# EAGLE design boardv02 (EAGLE 9.6.2)
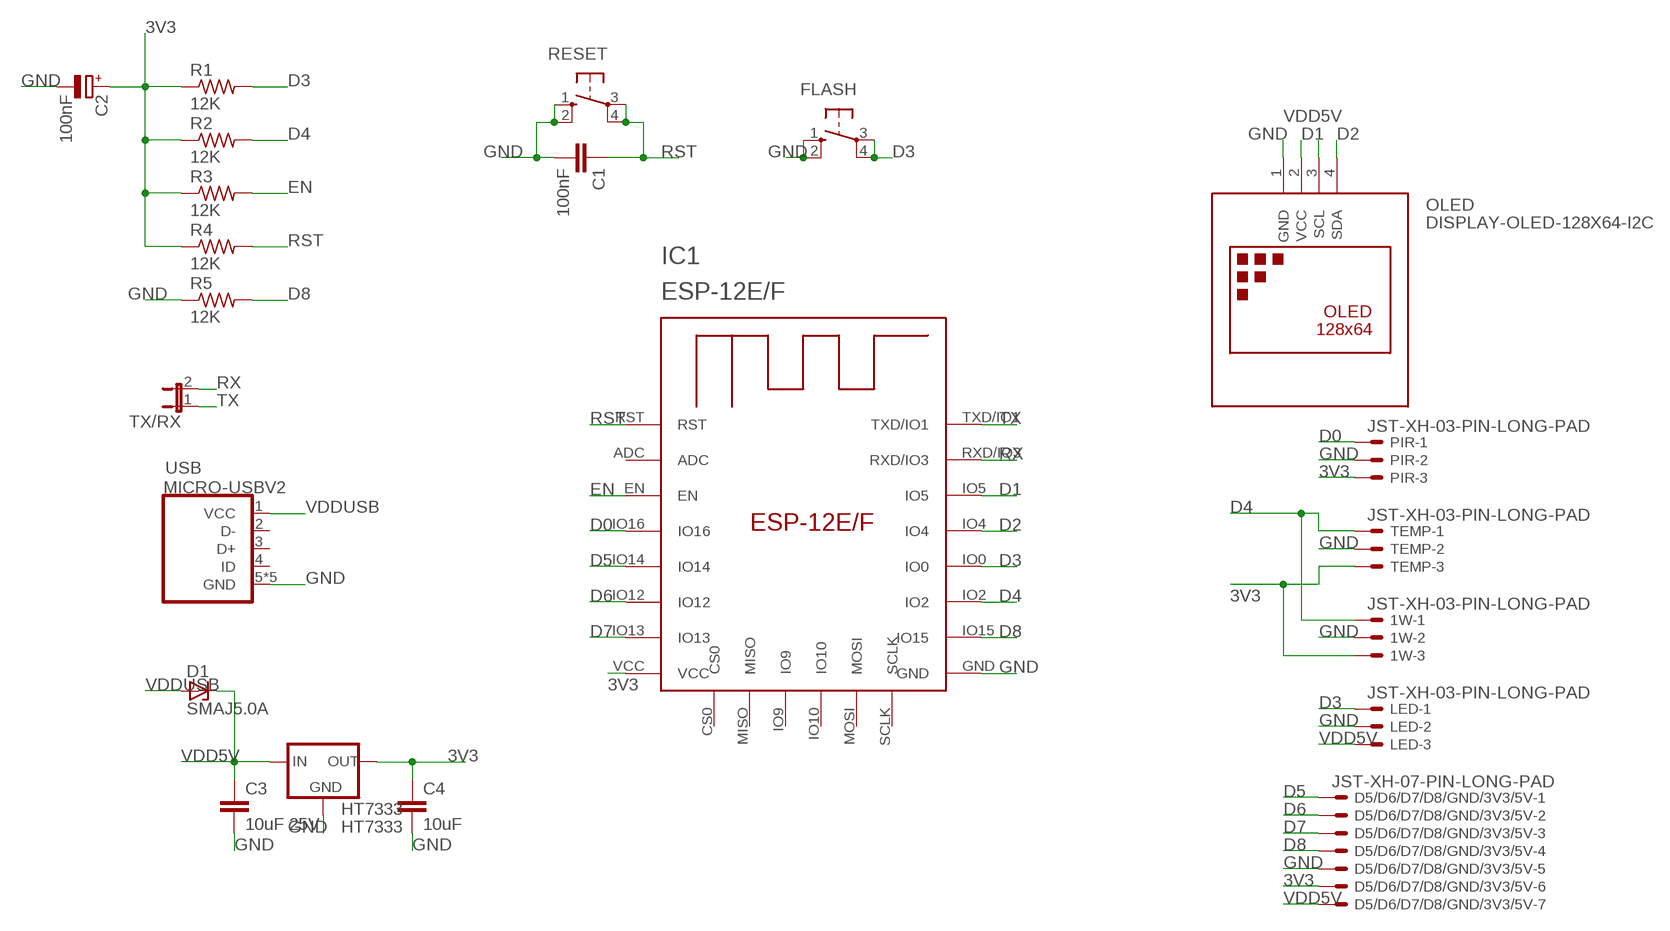
[diagram p0: schematic, sheet 1]

## Parts
1W  JST-XH-03-PIN-LONG-PAD  [JST-XH-03-PACKAGE-LONG-PAD]
C1  100nF  C-EUC0805  [C0805]
C2  100nF  CPOL-EUR/2012-12R  [R/2012-12R]
C3  10uF 25V  C-EUC0805  [C0805]
C4  10uF  C-EUC0805  [C0805]
D1  SMAJ5.0A  [DO214AC]
D5/D6/D7/D8/GND/3V3/5V  JST-XH-07-PIN-LONG-PAD  [JST-XH-07-PACKAGE-LONG-PAD]
FLASH  10-XX  [B3F-10XX]
HT7333  HT7333  [SOT-89]
IC1  ESP-12E/F  [ESP-12E]
LED  JST-XH-03-PIN-LONG-PAD  [JST-XH-03-PACKAGE-LONG-PAD]
OLED  DISPLAY-OLED-128X64-I2C  [DISPLAY-OLED-128X64-I2C]
PIR  JST-XH-03-PIN-LONG-PAD  [JST-XH-03-PACKAGE-LONG-PAD]
R1  12K  R-US_R1206  [R1206]
R2  12K  R-US_R1206  [R1206]
R3  12K  R-US_R1206  [R1206]
R4  12K  R-US_R1206  [R1206]
R5  12K  R-US_R1206  [R1206]
RESET  10-XX  [B3F-10XX]
TEMP  JST-XH-03-PIN-LONG-PAD  [JST-XH-03-PACKAGE-LONG-PAD]
TX/RX  JP1E  [JP1]
USB  MICRO-USBV2  [MICRO-USB-2]

## Nets
3V3: 1W.3 C2.+ C4.1 D5/D6/D7/D8/GND/3V3/5V.6 HT7333.1(OUT) IC1.VCC PIR.3 R1.1 R2.1 R3.1 R4.1 TEMP.3
D0: IC1.IO16 PIR.1
D1: IC1.IO5 OLED.3(SCL)
D2: IC1.IO4 OLED.4(SDA)
D3: FLASH.3(P) FLASH.4(P1) IC1.IO0 LED.1 R1.2
D4: 1W.1 IC1.IO2 R2.2 TEMP.1
D5: D5/D6/D7/D8/GND/3V3/5V.1 IC1.IO14
D6: D5/D6/D7/D8/GND/3V3/5V.2 IC1.IO12
D7: D5/D6/D7/D8/GND/3V3/5V.3 IC1.IO13
D8: D5/D6/D7/D8/GND/3V3/5V.4 IC1.IO15 R5.2
EN: IC1.EN R3.2
GND: 1W.2 C1.2 C2.- C3.2 C4.2 D5/D6/D7/D8/GND/3V3/5V.5 FLASH.1(S) FLASH.2(S1) HT7333.2(GND) IC1.GND LED.2 OLED.1(GND) PIR.2 R5.1 RESET.1(S) RESET.2(S1) TEMP.2 USB.5(GND) USB.P$1(GND) USB.P$2(GND) USB.P$3(GND) USB.P$4(GND)
RST: C1.1 IC1.RST R4.2 RESET.3(P) RESET.4(P1)
RX: IC1.RXD/IO3 TX/RX.2
TX: IC1.TXD/IO1 TX/RX.1
VDD5V: C3.1 D1.C D5/D6/D7/D8/GND/3V3/5V.7 HT7333.3(IN) HT7333.4(IN) LED.3 OLED.2(VCC)
VDDUSB: D1.A USB.1(VCC)
Unconnected: IC1.ADC IC1.CS0 IC1.IO9 IC1.IO10 IC1.MISO IC1.MOSI IC1.SCLK USB.2(D-) USB.3(D+) USB.4(ID)

## Library data of the parts
1W LED PIR TEMP = Rembrandt Electronics - JST XH Connectors v1-0:JST-XH-03-PIN: JST XH Connector 2 Pin Wire to board connector. Pitch: 2,54 mm, (0.100") Number of pins: 3 Created by Rembrandt Electronics www.rembrandtelectronics.com
C1 C3 C4 = resistor:C-EU: CAPACITOR, European symbol
C2 = resistor:CPOL-EU: POLARIZED CAPACITOR, European symbol
D1 = smaj_10:SMAJ*A: SMAJ Series TVS Diodes Source: http://www.littelfuse.com/~/media/electronics/datasheets/tvs_diodes/littelfuse_tvs_diode_smaj_datasheet.pdf.pdf; MF: Littelfuse; MPN: SMAJ5.0A; OC_FARNELL: 1827607; OC_NEWARK: 71J2029
D5/D6/D7/D8/GND/3V3/5V = Rembrandt Electronics - JST XH Connectors v1-0:JST-XH-07-PIN: JST XH Connector 2 Pin Wire to board connector. Pitch: 2,54 mm, (0.100") Number of pins: 7 Created by Rembrandt Electronics www.rembrandtelectronics.com
FLASH RESET = switch-omron:10-XX: OMRON SWITCH; MPN: B3F-1000; OC_FARNELL: 176432; OC_NEWARK: 36M3542
HT7333 = holtek2:HT73*
IC1 = esp-12e-f:ESP-12E/F
OLED = diy-modules:DISPLAY-OLED-128X64-I2C: 128x64 Dot Matrix OLED Module based on SSD1306 chip Variant with I2C interface More details available here: http://www.instructables.com/id/Monochrome-096-i2c-OLED-display-with-arduino-SSD13/ SSD1306 datasheet: https://cdn-shop.adafruit.com/datasheets/SSD1306.pdf Click here to find device on ebay.com <http://www.ebay.com/sch/oled+display+128x64+iic> Note: There are two variants: I2C and SPI. Search for the proper version.
R1 = resistor:R-US_: RESISTOR, American symbol; SPICEPREFIX: R
R2-R5 = resistor:R-US_: RESISTOR, American symbol
TX/RX = jumper:JP1E: JUMPER
USB = microusb:MICRO-USB: Micro USB B connector

## Board
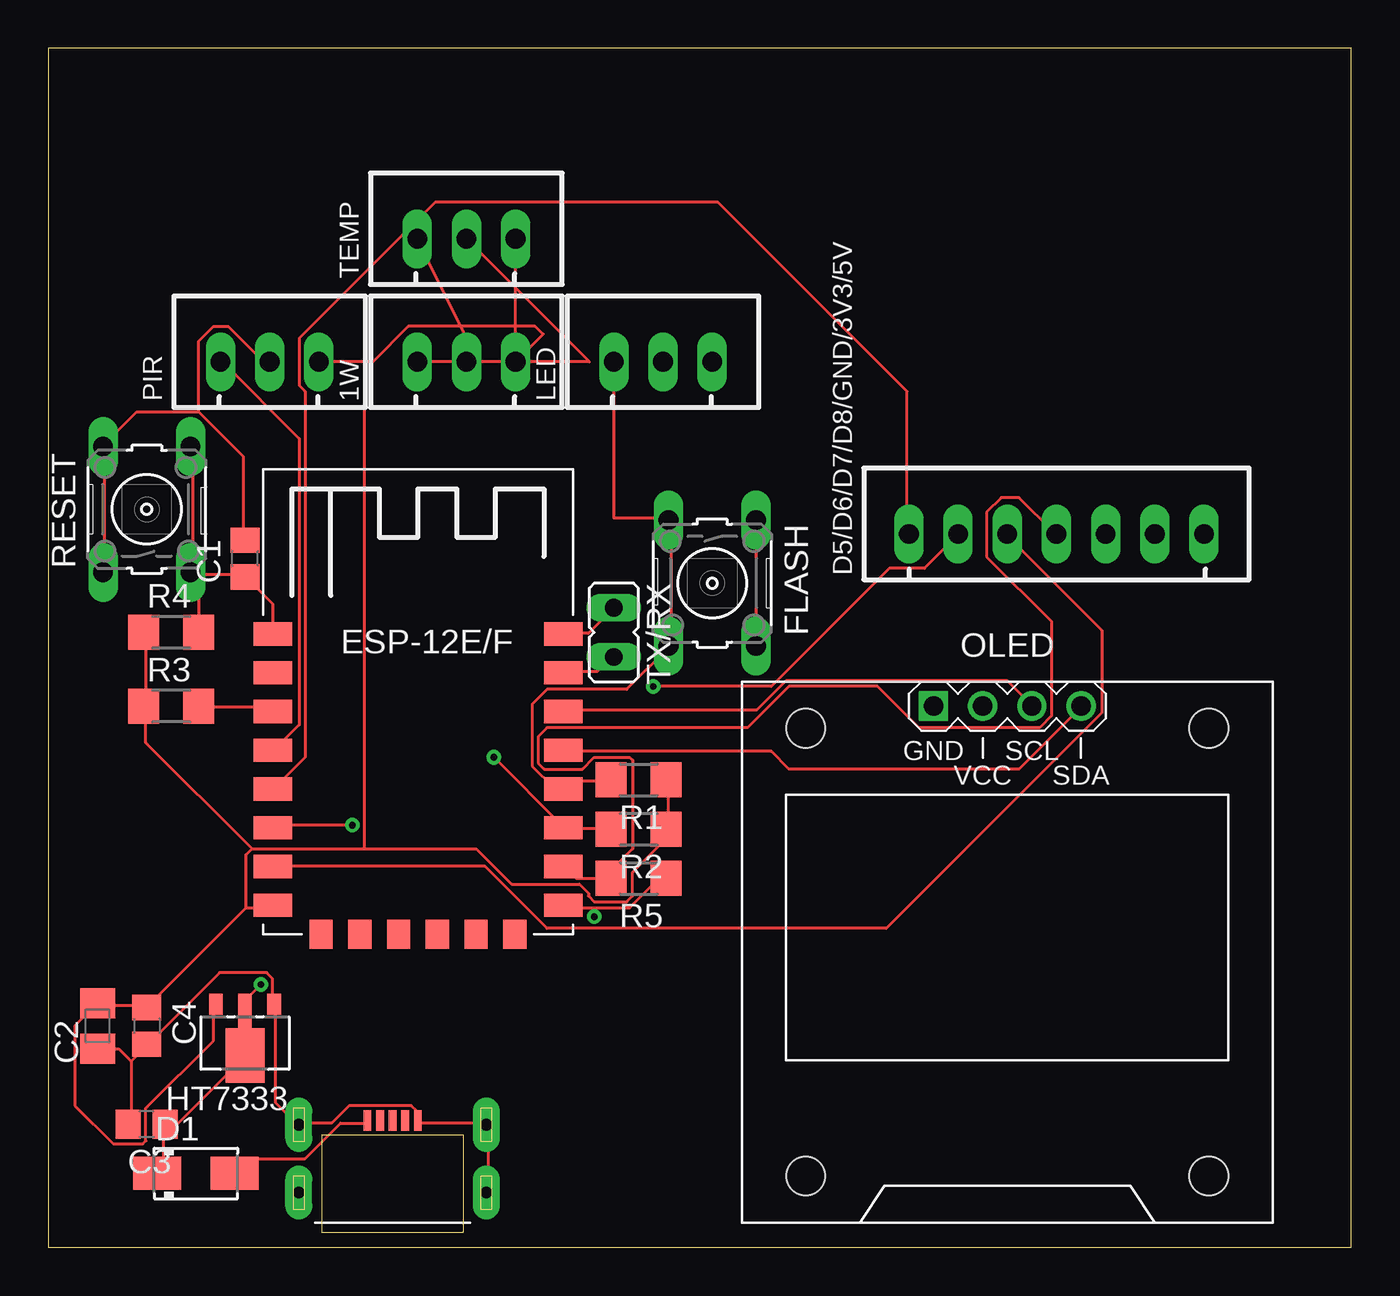
[diagram p1: board, top side]
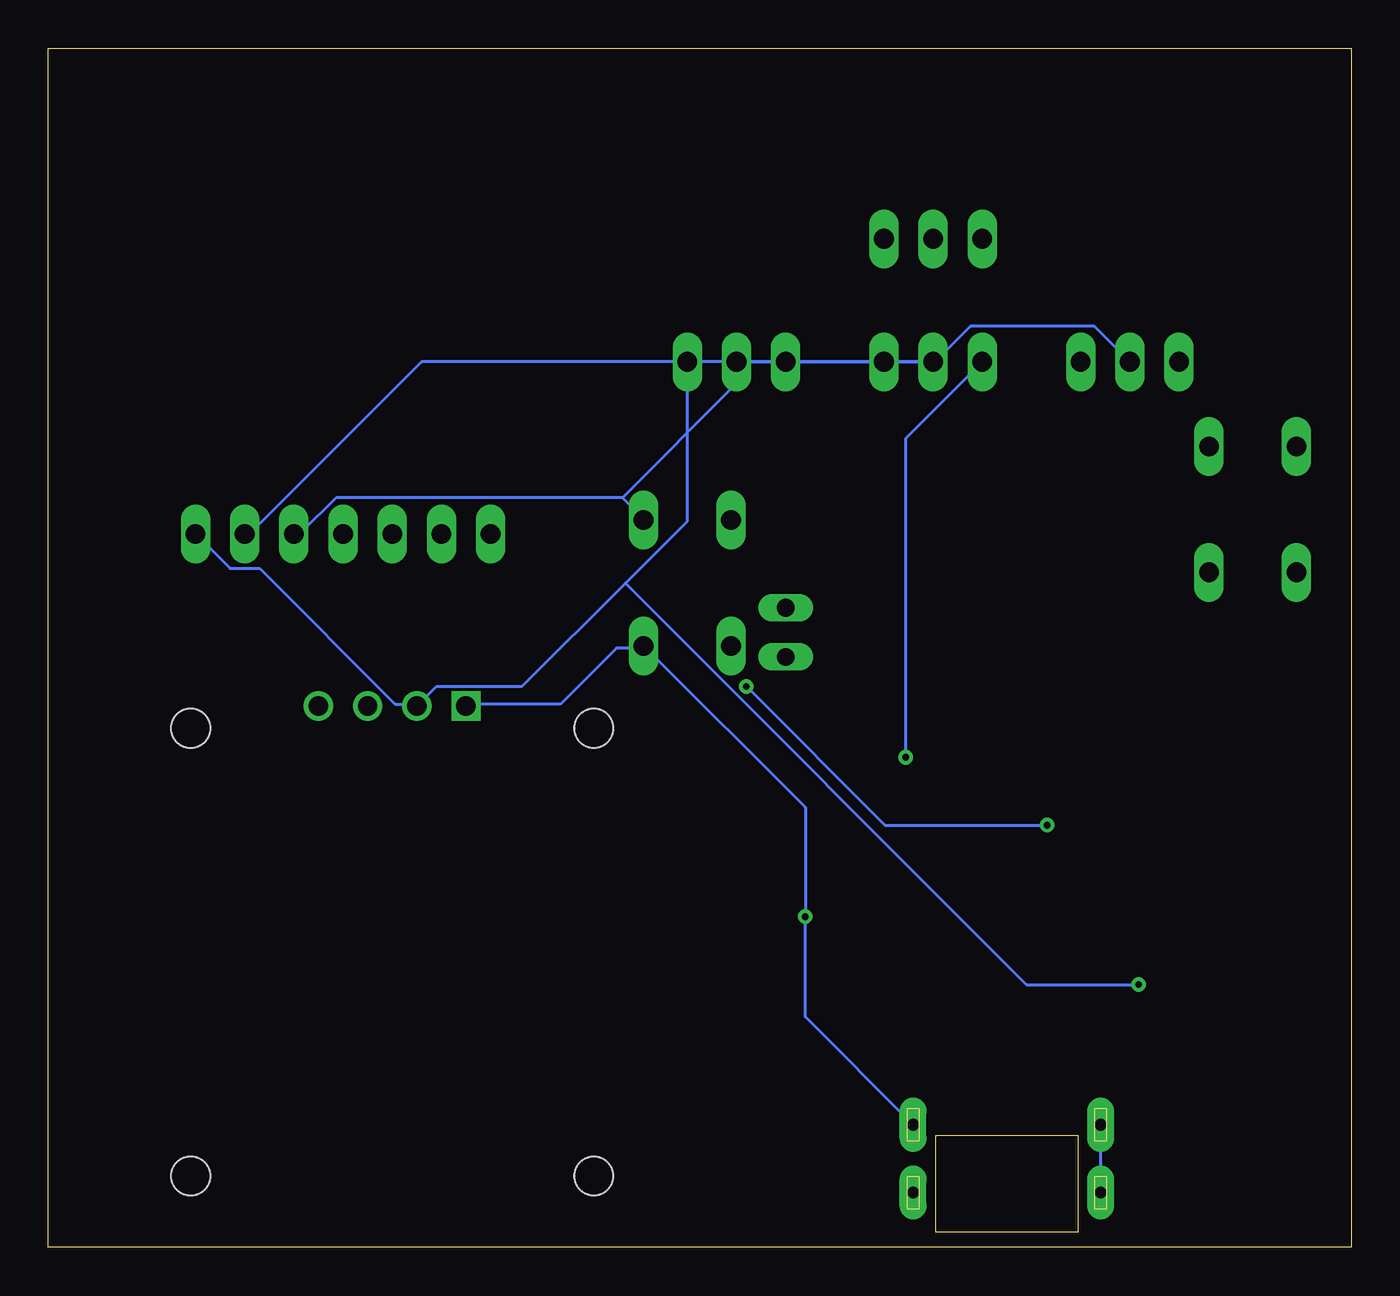
[diagram p2: board, bottom side, seen from below]

Size 67.29 x 61.9 mm. Coordinates in mm from the lower left corner, seen from the top.
Outline: 0,0 67.29,0 67.29,61.9 0,61.9 0,0
Copper layers (1*16): Top 0.035mm / dielectric 1.5mm / Bottom 0.035mm
Design rules "default": minimum track width 6mil, minimum drill 0.35mm, track to track 6mil, track to pad 6mil, pad to pad 6mil, via to via 6mil, smd to smd 6mil, copper to edge 40mil, drill to drill 6mil, minimum pad ring 10mil, minimum via ring 8mil, stop-mask expansion 4mil, vias tented up to drill 0mil, thermal gap 10mil

### Footprints (pad centres in the part's own frame; a part is rotated, then mirrored left to right if it is on the bottom)
JST-XH-03-PACKAGE-LONG-PAD = drill 1.016 long: 1 -2.54,0; 2 0,0; 3 2.54,0
C0805 = smd 1.3 x 1.5: 1 -0.95,0; 2 0.95,0
R/2012-12R = smd 1.55 x 1.8: + 1.175,0; - -1.175,0
DO214AC = smd 2.5 x 1.7: A 2,0; C -2,0
JST-XH-07-PACKAGE-LONG-PAD = drill 1.016 long: 1 -7.62,0; 2 -5.08,0; 3 -2.54,0; 4 0,0; 5 2.54,0; 6 5.08,0; 7 7.62,0
B3F-10XX = drill 1.016 long: 1 -3.251,2.261; 2 3.251,2.261; 3 -3.251,-2.261; 4 3.251,-2.261
SOT-89 = smd 0.7 x 1.1: 1 1.5,-2.385; 2 -1.5,-2.385 | smd 0.7 x 1.8: 3 0,-2.035 | smd 2 x 2.8: 4 0,0.265
ESP-12E = smd 2 x 1.2: ADC -7.46,5.53; EN -7.46,3.53; GND 7.54,-6.47; IO0 7.54,-0.47; IO2 7.54,-2.47; IO4 7.54,1.53; IO5 7.54,3.53; IO12 -7.46,-2.47; IO13 -7.46,-4.47; IO14 -7.46,-0.47; IO15 7.54,-4.47; IO16 -7.46,1.53; RST -7.46,7.53; RXD/IO3 7.54,5.53; TXD/IO1 7.54,7.53; VCC -7.46,-6.47 | smd 1.2 x 1.5: CS0 -4.96,-7.97; IO9 -0.96,-7.97; IO10 1.04,-7.97; MISO -2.96,-7.97; MOSI 3.04,-7.97; SCLK 5.04,-7.97
DISPLAY-OLED-128X64-I2C = drill 1 square: 1 -3.81,12.7 | drill 1: 2 -1.27,12.7; 3 1.27,12.7; 4 3.81,12.7 | hole 2: -10.414,11.557; 10.414,11.557; 10.414,-11.557; -10.414,-11.557
R1206 = smd 1.6 x 1.803: 1 -1.422,0; 2 1.422,0
JP1 = drill 0.914 long: 1 0,-1.27; 2 0,1.27
MICRO-USB-2 = smd 0.4 x 1.05: 1 -1.3,5.275; 2 -0.65,5.275; 3 0,5.275; 4 0.65,5.275; 5 1.3,5.275 | drill 0.6 pad 1.4 long: P$1 -4.85,5.05; P$2 -4.85,1.55; P$3 4.85,5.05; P$4 4.85,1.55

### Placement (x,y rotation side)
1W  21.59,45.72 0 top
C1  10.16,35.56 90 top
C2  2.54,11.43 90 top
C3  5.08,6.35 180 top
C4  5.08,11.43 270 top
D1  7.62,3.81 0 top
D5/D6/D7/D8/GND/3V3/5V  52.07,36.83 0 top
FLASH  34.29,34.29 270 top
HT7333  10.16,10.16 180 top
IC1  19.05,24.13 0 top
LED  31.75,45.72 0 top
OLED  49.53,15.24 0 top
PIR  11.43,45.72 0 top
R1  30.48,24.13 180 top
R2  30.48,21.59 180 top
R3  6.35,27.94 0 top
R4  6.35,31.75 0 top
R5  30.48,19.05 180 top
RESET  5.08,38.1 90 top
TEMP  21.59,52.07 0 top
TX/RX  29.21,31.75 180 top
USB  17.78,1.27 0 top

### Tracks (layer width: path | path; a pad name or v marks a point on that pad's centre or on a via)
3V3
  Top 0.152: R4.1 5.03,31.7 5.03,28.04 R3.1 5.03,27.89 5.03,26.06 10.52,20.57 | R1.1 32,24.08 32,21.64 R2.1 31.85,21.49 31.85,21.03 30.18,19.36 30.18,18.14 29.87,17.83 28.19,17.83 27.89,18.14 27.89,18.29 27.43,18.75 23.93,18.75 22.1,20.57 16.31,20.57 | HT7333.1 8.53,12.5 8.53,10.67 5.03,7.16 5.03,5.49 4.88,5.33 3.35,5.33 1.37,7.32 1.37,11.43 2.44,12.5 C2.+ 2.59,12.5 5.03,12.5 C4.1 5.18,12.5 10.21,17.53 | 10.21,17.53 11.58,17.53 IC1.VCC | 10.52,20.57 16.31,20.57 | 10.52,20.57 10.21,20.27 10.21,17.53 | 16.31,45.72 16.76,45.72 18.59,47.55 25.15,47.55 25.55,47.14 1W.3 TEMP.3 | 16.31,45.72 PIR.3 | 16.31,45.72 16.31,20.57
  Bottom 0.152: 1W.3 48.01,45.72 56.84,36.88 57.15,36.88 D5/D6/D7/D8/GND/3V3/5V.6
D0
  Top 0.152: IC1.IO16 11.73,25.76 12.95,26.98 12.95,41.76 8.99,45.72 PIR.1
D1
  Top 0.152: IC1.IO5 26.67,27.74 36.58,27.74 38.1,29.26 49.53,29.26 50.75,28.04 OLED.3
D2
  Top 0.152: IC1.IO4 26.67,25.6 37.34,25.6 38.25,24.69 50.14,24.69 53.34,27.89 OLED.4
D3
  Top 0.152: R1.2 28.96,24.08 26.98,24.08 26.67,23.77 IC1.IO0 26.52,23.77 26.06,23.77 24.99,24.84 24.99,28.04 25.76,28.8 29.87,28.8 32,30.94 FLASH.4 32.16,31.09 32.16,37.49 FLASH.3 32,37.64 29.21,37.64 LED.1
D4  (via drill 0.35)
  Top 0.152: R2.2 28.96,21.64 26.67,21.64 IC1.IO2 26.52,21.79 v23.01,25.3 | TEMP.1 22.23,45.72 1W.1
  Bottom 0.152: 1W.1 23.01,41.76 v23.01,25.3
D5
  Top 0.152: IC1.IO14 11.73,23.77 13.26,25.3 13.26,44.2 12.95,44.5 12.95,46.94 19.96,53.95 34.59,53.95 44.35,44.2 44.35,36.88 D5/D6/D7/D8/GND/3V3/5V.1
D6  (via drill 0.35)
  Top 0.152: v15.7,21.79 11.73,21.79 IC1.IO12 | v31.24,28.96 37.34,28.96 43.43,35.05 45.26,35.05 46.94,36.73 D5/D6/D7/D8/GND/3V3/5V.2
  Bottom 0.152: v15.7,21.79 24.08,21.79 v31.24,28.96
D7
  Top 0.152: IC1.IO13 11.73,19.66 22.55,19.66 25.76,16.46 43.28,16.46 54.41,27.58 54.41,31.85 49.53,36.73 D5/D6/D7/D8/GND/3V3/5V.3
D8
  Top 0.152: IC1.IO15 26.67,19.66 27.28,19.05 R5.2 29.11,19.05 29.11,19.51 30.18,20.57 30.18,25.15 30.02,25.3 28.19,25.3 27.58,24.69 25.6,24.69 25.3,24.99 25.3,26.36 25.76,26.82 36.12,26.82 38.25,28.96 42.82,28.96 44.96,26.82 51.21,26.82 51.82,27.43 51.82,32.31 48.46,35.66 48.46,37.95 49.23,38.71 50.14,38.71 51.97,36.88 D5/D6/D7/D8/GND/3V3/5V.4
EN
  Top 0.152: R3.2 7.77,27.89 11.43,27.89 11.58,27.74 IC1.EN
GND  (via drill 0.35)
  Top 0.152: 4.27,9.6 4.27,6.4 C3.2 | 4.27,9.6 5.03,10.36 C4.2 5.18,10.52 8.84,14.17 11.28,14.17 11.58,13.87 11.58,12.65 HT7333.2 11.73,12.5 11.73,7.47 12.8,6.4 USB.P$1 12.95,6.4 14.63,6.4 15.54,7.32 18.75,7.32 19.05,7.01 19.05,6.55 USB.5 19.2,6.4 22.55,6.4 USB.P$3 22.71,6.25 22.71,2.9 USB.P$4 | 4.27,9.6 3.66,10.21 2.59,10.21 C2.- | R5.1 31.55,19.05 30.02,17.53 28.19,17.53 | 28.19,17.53 26.67,17.53 IC1.GND | v28.19,17.07 28.19,17.53 | 7.77,43.13 10.06,40.84 10.06,36.58 C1.2 | 7.77,43.13 4.57,43.13 2.9,41.45 RESET.2 2.9,41.3 2.9,34.9 RESET.1 | PIR.2 11.12,45.72 9.3,47.55 8.53,47.55 7.77,46.79 7.77,43.13 | 1W.2 27.94,45.72 TEMP.2 | FLASH.1 36.58,37.49 36.58,31.09 FLASH.2
  Bottom 0.152: USB.P$2 12.95,2.9 12.95,6.25 USB.P$1 | USB.P$3 22.71,6.4 28.19,11.89 v28.19,17.07 28.19,22.71 36.42,30.94 FLASH.2 36.58,30.94 37.95,30.94 40.84,28.04 45.72,28.04 OLED.1 | PIR.2 13.26,47.55 19.66,47.55 21.49,45.72 LED.2 1W.2 31.85,45.72 31.85,44.5 37.64,38.71 | 37.64,38.71 52.43,38.71 54.25,36.88 54.56,36.88 D5/D6/D7/D8/GND/3V3/5V.5 | 37.64,38.71 36.58,37.64 FLASH.1
RST
  Top 0.152: 7.77,34.75 7.47,34.75 RESET.3 | 7.77,34.75 10.06,34.75 C1.1 10.21,34.59 11.58,33.22 11.58,31.7 IC1.RST | 7.77,34.75 7.77,31.85 R4.2 | 7.77,34.75 RESET.3 | RESET.4 7.47,41.3 7.47,34.9 RESET.3
RX
  Top 0.152: IC1.RXD/IO3 26.67,29.72 28.35,29.72 29.11,30.48 TX/RX.2
TX
  Top 0.152: TX/RX.1 27.89,31.7 26.67,31.7 IC1.TXD/IO1
VDD5V  (via drill 0.35)
  Top 0.152: D1.C 5.64,3.81 5.94,4.12 5.94,6.25 C3.1 6.1,6.4 6.71,6.4 10.06,9.75 HT7333.4 10.21,9.91 10.21,12.19 HT7333.3 10.21,12.34 10.21,12.8 v10.97,13.56
  Bottom 0.152: D5/D6/D7/D8/GND/3V3/5V.7 57.91,35.05 56.39,35.05 49.38,28.04 48.31,28.04 OLED.2 47.24,28.96 42.82,28.96 37.49,34.29 | LED.3 34.29,37.49 37.49,34.29 | v10.97,13.56 16.76,13.56 37.49,34.29
VDDUSB
  Top 0.152: USB.1 16.46,6.4 15.09,6.4 13.26,4.57 10.52,4.57 9.75,3.81 D1.A